# EAGLE design servo (EAGLE 7.2.0)
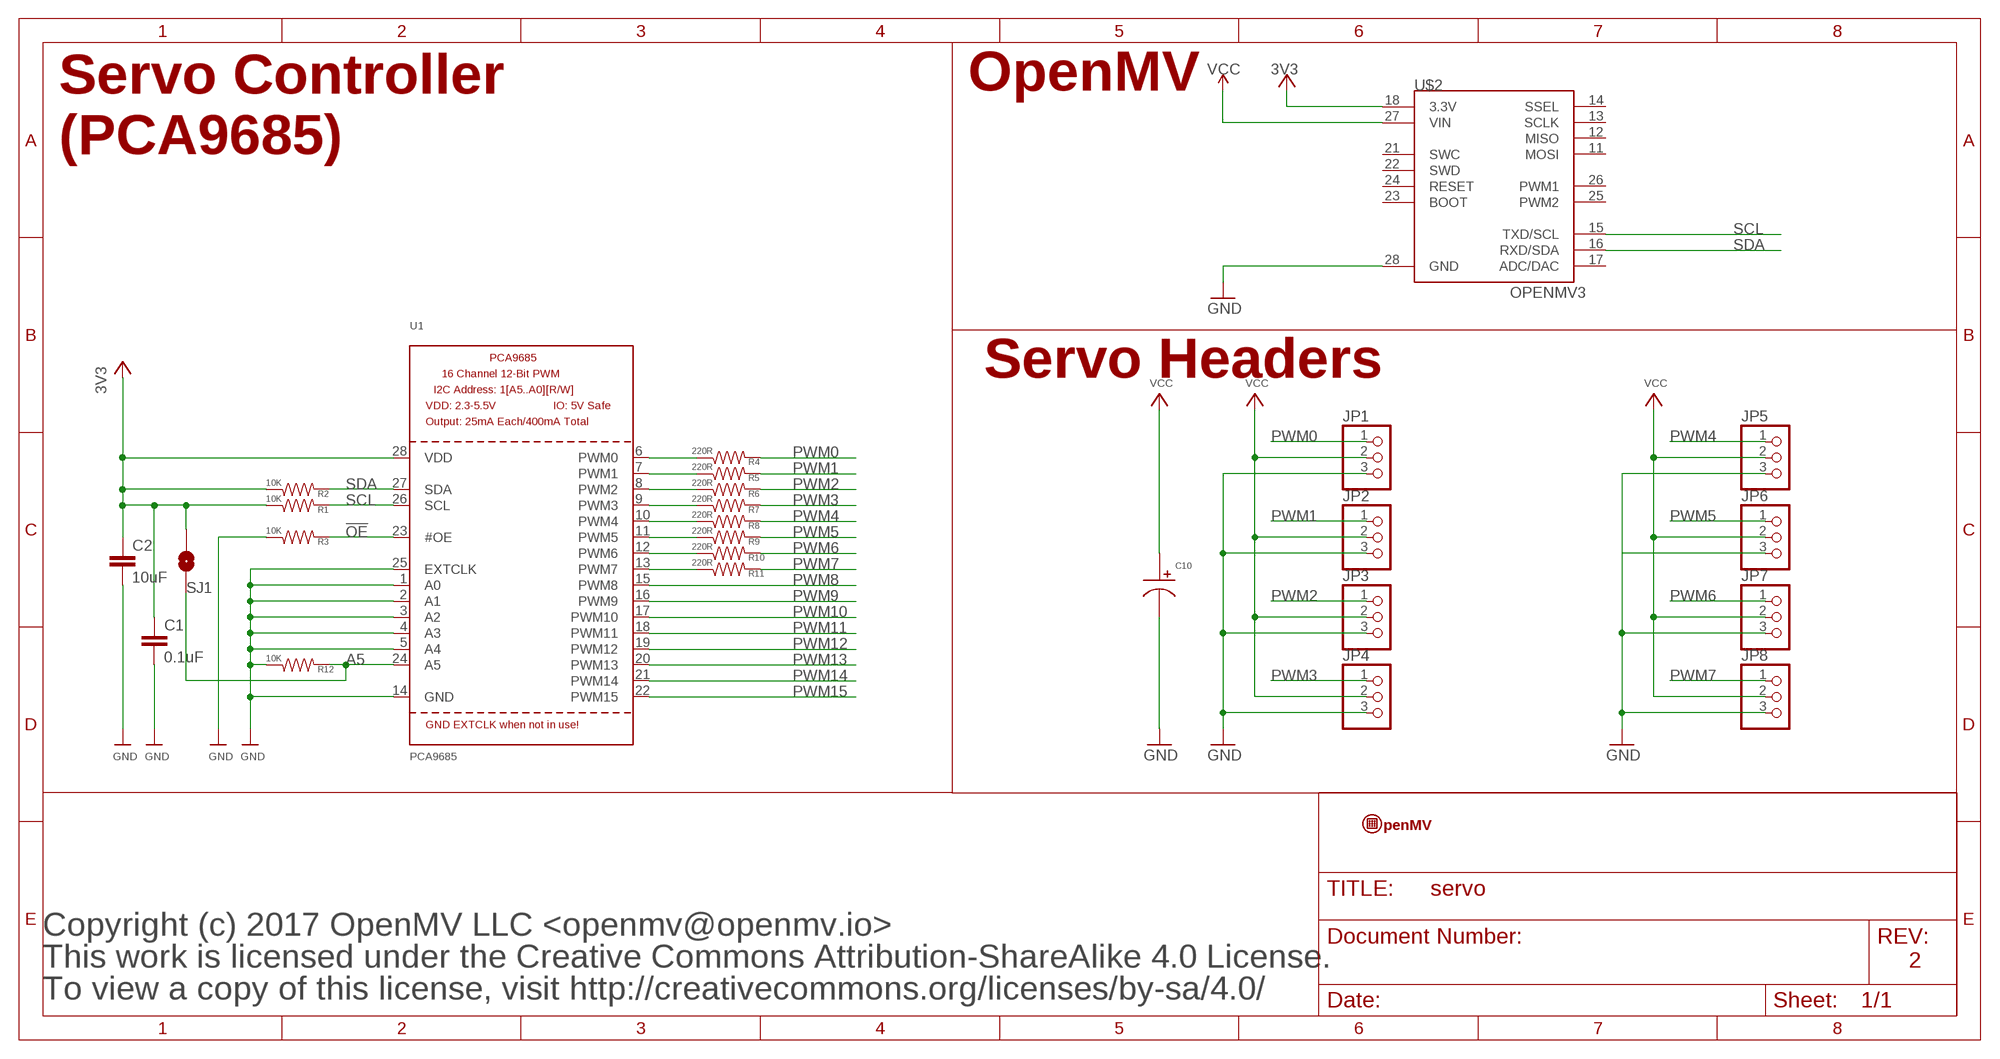
[diagram p0: schematic, sheet 1]

## Parts
C1  0.1uF  CAP0603-CAP  [0603-CAP]
C2  10uF  CAP0805  [0805]
C10  CAPACITOR_P_10MM  [CP10MM]
JP1  PINHD-1X3  [1X03]
JP2  PINHD-1X3  [1X03]
JP3  PINHD-1X3  [1X03]
JP4  PINHD-1X3  [1X03]
JP5  PINHD-1X3  [1X03]
JP6  PINHD-1X3  [1X03]
JP7  PINHD-1X3  [1X03]
JP8  PINHD-1X3  [1X03]
R1  10K  RESISTOR0603-RES  [0603-RES]
R2  10K  RESISTOR0603-RES  [0603-RES]
R3  10K  RESISTOR0603-RES  [0603-RES]
R4  220R  RESISTOR0603-RES  [0603-RES]
R5  220R  RESISTOR0603-RES  [0603-RES]
R6  220R  RESISTOR0603-RES  [0603-RES]
R7  220R  RESISTOR0603-RES  [0603-RES]
R8  220R  RESISTOR0603-RES  [0603-RES]
R9  220R  RESISTOR0603-RES  [0603-RES]
R10  220R  RESISTOR0603-RES  [0603-RES]
R11  220R  RESISTOR0603-RES  [0603-RES]
R12  10K  RESISTOR0603-RES  [0603-RES]
SJ1  SOLDERJUMPERNO  [SJ_2S-NO]
U1  PCA9685  [TSSOP28]
U$2  OPENMV3  [OPENMV3]
U$9  OPENMV-LOGO  [OPENMV-LOGO]

## Nets
3V3: C1.1 C2.1 R1.1 R2.1 SJ1.2 U1.28(VDD) U$2.18(3.3V)
!OE: R3.2 U1.23(#OE)
A5: R12.2 SJ1.1 U1.24(A5)
C3: R11.1 U1.13(PWM7)
GND: C1.2 C2.2 C10.P$2 JP1.3 JP2.3 JP3.3 JP4.3 JP5.3 JP6.3 JP7.3 JP8.3 R3.1 R12.1 U1.1(A0) U1.2(A1) U1.3(A2) U1.4(A3) U1.5(A4) U1.14(GND) U1.25(EXTCLK) U$2.28(GND)
N$1: R4.1 U1.6(PWM0)
N$2: R5.1 U1.7(PWM1)
N$3: R6.1 U1.8(PWM2)
N$4: R7.1 U1.9(PWM3)
N$5: R8.1 U1.10(PWM4)
N$6: R9.1 U1.11(PWM5)
N$7: R10.1 U1.12(PWM6)
PWM0: JP1.1 R4.2
PWM1: JP2.1 R5.2
PWM2: JP3.1 R6.2
PWM3: JP4.1 R7.2
PWM4: JP5.1 R8.2
PWM5: JP6.1 R9.2
PWM6: JP7.1 R10.2
PWM7: JP8.1 R11.2
PWM8: U1.15(PWM8)
PWM9: U1.16(PWM9)
PWM10: U1.17(PWM10)
PWM11: U1.18(PWM11)
PWM12: U1.19(PWM12)
PWM13: U1.20(PWM13)
PWM14: U1.21(PWM14)
PWM15: U1.22(PWM15)
SCL: R1.2 U1.26(SCL) U$2.15(TXD/SCL)
SDA: R2.2 U1.27(SDA) U$2.16(RXD/SDA)
VCC: C10.P$1 JP1.2 JP2.2 JP3.2 JP4.2 JP5.2 JP6.2 JP7.2 JP8.2 U$2.27(VIN)
Unconnected: U$2.11(MOSI) U$2.12(MISO) U$2.13(SCLK) U$2.14(SSEL) U$2.17(ADC/DAC) U$2.21(SWC) U$2.22(SWD) U$2.23(BOOT) U$2.24(RESET) U$2.25(PWM2) U$2.26(PWM1)

## Notes on the sheet
- OpenMV
- Servo Controller
  (PCA9685)
- Servo Headers
- Copyright (c) 2017 OpenMV LLC <openmv@openmv.io>
- This work is licensed under the Creative Commons Attribution-ShareAlike 4.0 License. | 2
- To view a copy of this license, visit http://creativecommons.org/licenses/by-sa/4.0/

## Library data of the parts
C1 C2 = sfe:CAP: Capacitor Standard 0603 ceramic capacitor, and 0.1" leaded capacitor.
C10 = MF_Passives:CAPACITOR_P: Library: MF_Passives Description: Device for Polarized Capacitors. Manufacture part number (MFG#), Voltage Rating, and Tolerance can be added via Attributes.; MGF#: N/A; TOLERANCE: N/A; VOLTAGE: N/A
JP1-JP8 = pinhead:PINHD-1X3: PIN HEADER
R1-R12 = sfe:RESISTOR: Resistor Basic schematic elements and footprints for 0603, 1206, and PTH resistors.
SJ1 = sfe:SOLDERJUMPER: Solder Jumper Standard SMD solder jumper. Used to automate production. Two varients : Normally Open and Normally Closed are the same, but have different paste layers. NC will have a large amount of paste and should jumper during reflow.
U1 = microbuilder:PCA9685: PCA9685 - 16 Channel 12-Bit I2C PWM Controller 5.0V tolerant 16 channel, 12-bit I2C PWM controller with 25mA per output (max. 400mA total) Digikey: 568-5931-1-ND
U$2 = openmv:OPENMV3
U$9 = openmv:OPENMV-LOGO

## Net classes
1 vcc: width 1.016 mm, clearance 0.203 mm
2 antenna: width 0.363 mm, clearance 0.305 mm
3 1.8v: width 0.457 mm, clearance 0.254 mm

## Board
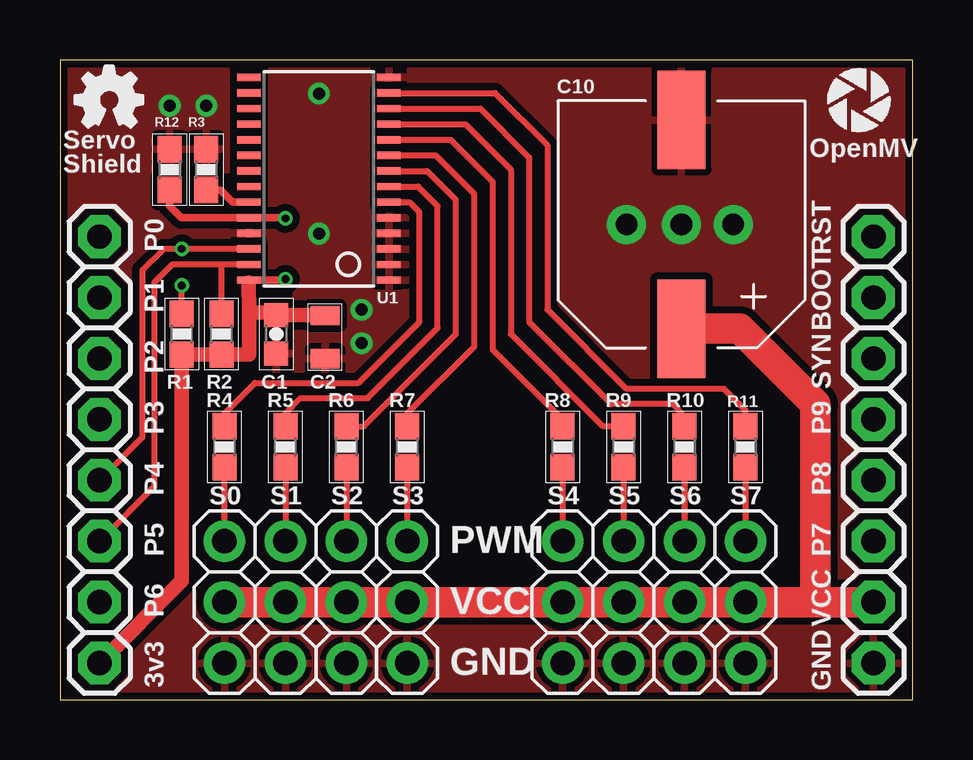
[diagram p1: board, top side]
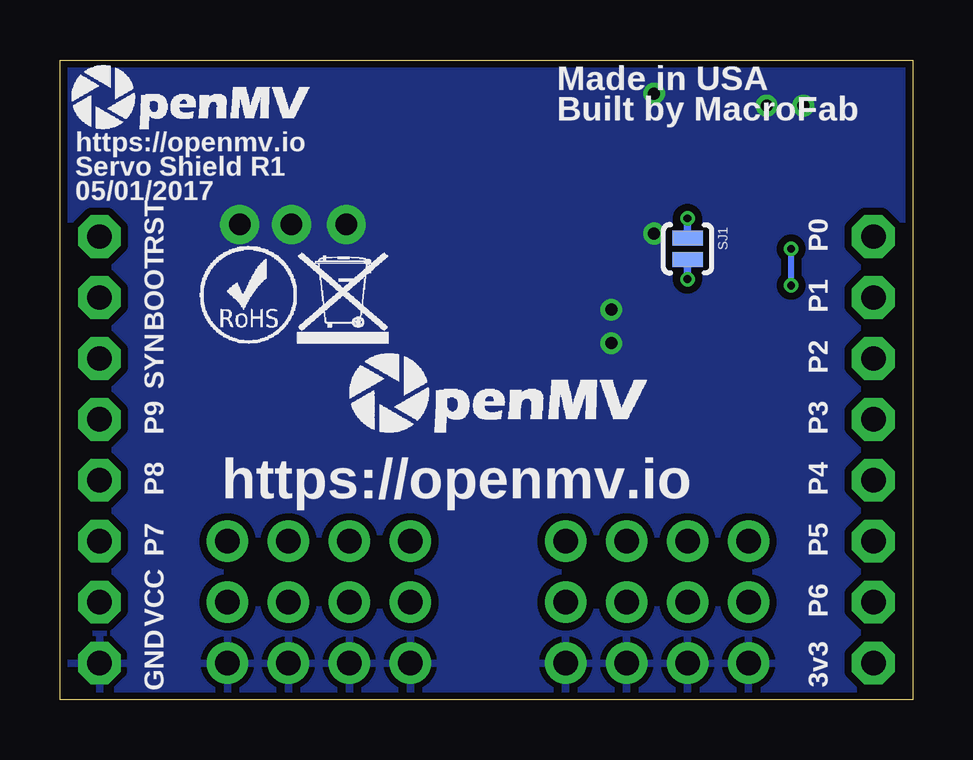
[diagram p2: board, bottom side, seen from below]

Size 35.56 x 26.67 mm. Coordinates in mm from the lower left corner, seen from the top.
Outline: 0,0 35.56,0 35.56,26.67 0,26.67 0,0
Copper layers (1*16): Top 0.035mm / dielectric 1.5mm / Bottom 0.035mm
Design rules "openmv3 *": minimum track width 5mil, minimum drill 10mil, track to track 8mil, track to pad 8mil, pad to pad 8mil, via to via 8mil, smd to smd 8mil, copper to edge 5mil, drill to drill 10mil, minimum pad ring 10mil, minimum via ring 4mil, stop-mask expansion 2mil, vias tented up to drill 30mil, thermal gap 10mil

### Footprints (pad centres in the part's own frame; a part is rotated, then mirrored left to right if it is on the bottom)
0603-CAP = smd 1 x 1: 1 -0.8,0; 2 0.8,0
0805 = smd 0.8 x 1.2: 1 -0.9,0; 2 0.9,0
CP10MM = smd 2 x 4.1: P$1 0,-4.35; P$2 0,4.35
1X03 = drill 1.016: 1 -2.54,0; 2 0,0; 3 2.54,0
0603-RES = smd 1.1 x 1: 1 -0.85,0; 2 0.85,0
SJ_2S-NO = smd 0.635 x 1.27: 1 -0.45,0; 2 0.45,0
TSSOP28 = smd 0.305 x 0.991: 1 -4.225,-2.918; 2 -3.575,-2.918; 3 -2.925,-2.918; 4 -2.275,-2.918; 5 -1.625,-2.918; 6 -0.975,-2.918; 7 -0.325,-2.918; 8 0.325,-2.918; 9 0.975,-2.918; 10 1.625,-2.918; 11 2.275,-2.918; 12 2.925,-2.918; 13 3.575,-2.918; 14 4.225,-2.918; 15 4.225,2.918; 16 3.575,2.918; 17 2.925,2.918; 18 2.275,2.918; 19 1.625,2.918; 20 0.975,2.918; 21 0.325,2.918; 22 -0.325,2.918; 23 -0.975,2.918; 24 -1.625,2.918; 25 -2.275,2.918; 26 -2.925,2.918; 27 -3.575,2.918; 28 -4.225,2.918
OPENMV3 = drill 1.016 pad 1.778 octagon: 11 1.651,19.304; 12 1.651,16.764; 13 1.651,14.224; 14 1.651,11.684; 15 1.651,9.144; 16 1.651,6.604; 17 1.651,4.064; 18 1.651,1.524; 21 33.909,19.304; 22 33.909,16.764; 23 33.909,14.224; 24 33.909,11.684; 25 33.909,9.144; 26 33.909,6.604; 27 33.909,4.064; 28 33.909,1.524

### Placement (x,y rotation side)
C1  9.02,15.24 270 top
C2  11.05,15.11 270 top
C10  25.91,19.81 0 top
JP1  6.86,4.06 270 top
JP2  9.4,4.06 270 top
JP3  11.94,4.06 270 top
JP4  14.48,4.06 270 top
JP5  20.95,4.06 270 top
JP6  23.5,4.06 270 top
JP7  26.04,4.06 270 top
JP8  28.57,4.06 270 top
R1  5.08,15.24 90 top
R2  6.73,15.24 90 top
R3  6.1,22.1 270 top
R4  6.86,10.54 270 top
R5  9.4,10.54 270 top
R6  11.94,10.54 270 top
R7  14.48,10.54 270 top
R8  20.95,10.54 270 top
R9  23.5,10.54 270 top
R10  26.04,10.54 270 top
R11  28.57,10.54 270 top
R12  4.57,22.1 270 top
SJ1  9.4,18.8 270 bottom
U1  10.79,21.72 90 top
U$2  0,0 0 top
U$3  [OMV-LOGO]  23.62,10.92 0 bottom
U$5  [ROHS]  29.72,14.86 0 bottom
U$6  [WEEE]  25.65,14.86 0 bottom
U$9  31.88,23.5 0 top
U$10  [OMV-LOGO-SMALL]  35.18,23.62 0 bottom
U$11  [OSHW_FILLX100_NOTEXT]  0.64,23.88 0 top

### Tracks (layer width: path | path; a pad name or v marks a point on that pad's centre or on a via)
3V3  (via drill 0.33)
  Top 0.305: U1.28 9.36,17.49 v9.4,17.53
  Top 0.406: 7.87,17.4 U1.28
  Top 0.61: C2.1 11.02,16.04 C1.1 9.02,16.13 7.88,16.13 | 7.88,16.13 7.88,14.39 R2.1 R1.1 5.08,4.95 U$2.18 | 7.88,16.13 7.87,17.4
  Bottom 0.305: v9.4,17.53 SJ1.2
!OE
  Top 0.305: U1.23 7.2,20.74 6.69,21.25 R3.2
A5  (via drill 0.33)
  Top 0.305: R12.2 4.57,20.57 5.05,20.09 U1.24 9.37,20.09 v9.4,20.07
  Bottom 0.305: SJ1.1 v9.4,20.07
C3
  Top 0.254: U1.13 18.14,25.29 20.32,23.11 20.32,16.26 23.62,12.95 27.69,12.95 28.57,12.06 R11.1
GND  (via drill 0.5, 0.9)
  other vias: 25.91,19.81 10.79,19.43 6.1,24.77 10.79,25.27 28.07,19.81 23.62,19.81 4.57,24.77 12.57,16.26 12.57,14.86
  pour Bottom (isolate 0.305): 0,0 35.56,0 35.56,26.67 0,26.67
  pour Top (isolate 0.305): 0,0 35.56,0 35.56,26.67 0,26.67
N$1
  Top 0.254: U1.6 14.56,20.74 14.99,20.32 14.99,15.75 12.45,13.21 8.13,13.21 6.86,11.94 R4.1
N$2
  Top 0.254: U1.7 14.93,21.39 15.75,20.57 15.75,15.49 12.83,12.57 10.03,12.57 9.4,11.94 R5.1
N$3
  Top 0.254: U1.8 15.3,22.04 16.51,20.83 16.51,15.24 12.66,11.39 R6.1
N$4
  Top 0.254: U1.9 15.66,22.69 17.27,21.08 17.27,14.73 14.48,11.94 R7.1
N$5
  Top 0.254: U1.10 16.28,23.34 18.03,21.59 18.03,14.61 20.95,11.68 R8.1
N$6
  Top 0.254: U1.11 16.9,23.99 18.8,22.1 18.8,15.24 22.64,11.39 R9.1
N$7
  Top 0.254: U1.12 17.52,24.64 19.56,22.61 19.56,15.75 22.99,12.32 25.53,12.32 26.04,11.81 R10.1
PWM0
  Top 0.254: JP1.1 R4.2
PWM1
  Top 0.254: R5.2 JP2.1
PWM2
  Top 0.254: R6.2 JP3.1
PWM3
  Top 0.254: R7.2 JP4.1
PWM4
  Top 0.254: R8.2 JP5.1
PWM5
  Top 0.254: R9.2 JP6.1
PWM6
  Top 0.254: R10.2 JP7.1
PWM7
  Top 0.254: R11.2 JP8.1
SCL  (via drill 0.33)
  Top 0.254: v5.08,18.79 v5.08,18.8 | R1.2 v5.08,17.27 | v5.08,18.79 4.31,18.79 3.43,17.91 3.43,10.92 U$2.15 | U1.26 v5.08,18.79
  Bottom 0.254: v5.08,17.27 v5.08,18.8
SDA
  Top 0.254: U1.27 6.73,18.14 | 6.73,18.14 4.68,18.14 3.94,17.4 3.94,8.89 U$2.16 | R2.2 6.73,18.14
VCC
  Top 1.27: U$2.27 31.5,4.06 | 31.5,4.06 JP8.2 JP7.2 JP6.2 JP5.2 JP4.2 JP3.2 JP2.2 JP1.2 | 31.5,4.06 31.5,12.32 28.35,15.46 C10.P$1

### Text on the board
tPlace: OpenMV | Servo / Shield | P0 | RST | P1 | BOOT | P2 | SYN | P3 | P9 | P4 | P8 | S0 | S1 | S2 | S3 | S4 | S5 | S6 | S7 | P5 | PWM | P7 | VCC | P6 | VCC | 3v3 | GND | GND
bPlace: Made in USA | Built by MacroFab | https://openmv.io | Servo Shield R1 | 05/01/2017 | P0 | RST | P1 | BOOT | P2 | SYN | P3 | P9 | P4 | P8 | https://openmv.io | P5 | P7 | P6 | VCC | 3v3 | GND